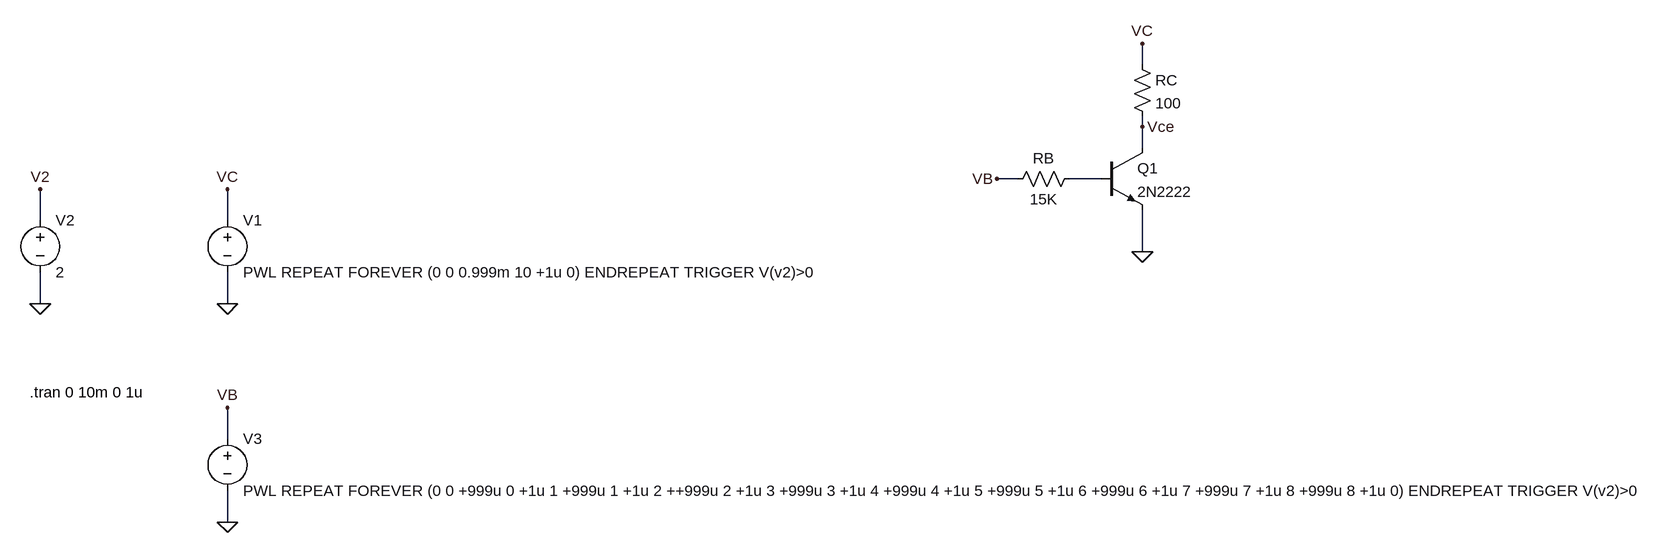
[diagram p0: schematic Draft15.asc]
Draft15.asc, the LTspice schematic file:
Version 4
SHEET 1 2500 680
WIRE 1536 -160 1536 -192
WIRE 1536 -64 1536 -80
WIRE 1536 -32 1536 -64
WIRE 1344 16 1312 16
WIRE 1472 16 1424 16
WIRE -160 80 -160 32
WIRE 128 80 128 32
WIRE 1536 128 1536 64
WIRE -160 208 -160 160
WIRE 128 208 128 160
WIRE 128 416 128 368
WIRE 128 544 128 496
FLAG -160 32 V2
FLAG -160 208 0
FLAG 128 32 VC
FLAG 128 208 0
FLAG 128 368 VB
FLAG 128 544 0
FLAG 1536 128 0
FLAG 1536 -192 VC
FLAG 1312 16 VB
FLAG 1536 -64 Vce
SYMBOL voltage 128 64 R0
WINDOW 123 0 0 Left 0
WINDOW 39 0 0 Left 0
SYMATTR InstName V1
SYMATTR Value PWL REPEAT FOREVER (0 0 0.999m 10 +1u 0) ENDREPEAT TRIGGER V(v2)>0
SYMBOL voltage -160 64 R0
SYMATTR InstName V2
SYMATTR Value 2
SYMBOL voltage 128 400 R0
SYMATTR InstName V3
SYMATTR Value PWL REPEAT FOREVER (0 0 +999u 0 +1u 1 +999u 1 +1u 2 ++999u 2 +1u 3 +999u 3 +1u 4 +999u 4 +1u 5 +999u 5 +1u 6 +999u 6 +1u 7 +999u 7 +1u 8 +999u 8 +1u 0) ENDREPEAT TRIGGER V(v2)>0
SYMBOL res 1520 -176 R0
SYMATTR InstName RC
SYMATTR Value 100
SYMBOL res 1440 0 R90
WINDOW 0 0 56 VBottom 2
WINDOW 3 32 56 VTop 2
SYMATTR InstName RB
SYMATTR Value 15K
SYMBOL npn 1472 -32 R0
SYMATTR InstName Q1
SYMATTR Value 2N2222
TEXT -176 344 Left 2 !.tran 0 10m 0 1u

The netlist it stands for:
* Draft15.asc
V1 VC 0 PWL REPEAT FOREVER (0 0 0.999m 10 +1u 0) ENDREPEAT TRIGGER V(v2)>0
V2 V2 0 2
V3 VB 0 PWL REPEAT FOREVER (0 0 +999u 0 +1u 1 +999u 1 +1u 2 ++999u 2 +1u 3 +999u 3 +1u 4 +999u 4 +1u 5 +999u 5 +1u 6 +999u 6 +1u 7 +999u 7 +1u 8 +999u 8 +1u 0) ENDREPEAT TRIGGER V(v2)>0
RC VC Vce 100
RB N001 VB 15K
Q1 Vce N001 0 0 2N2222
.model NPN NPN
.model PNP PNP
.lib standard.bjt
.tran 0 10m 0 1u
.backanno
.end